# Altium project Quadcopter Fligth Controller Board.PrjPcb (part 3 of 7)
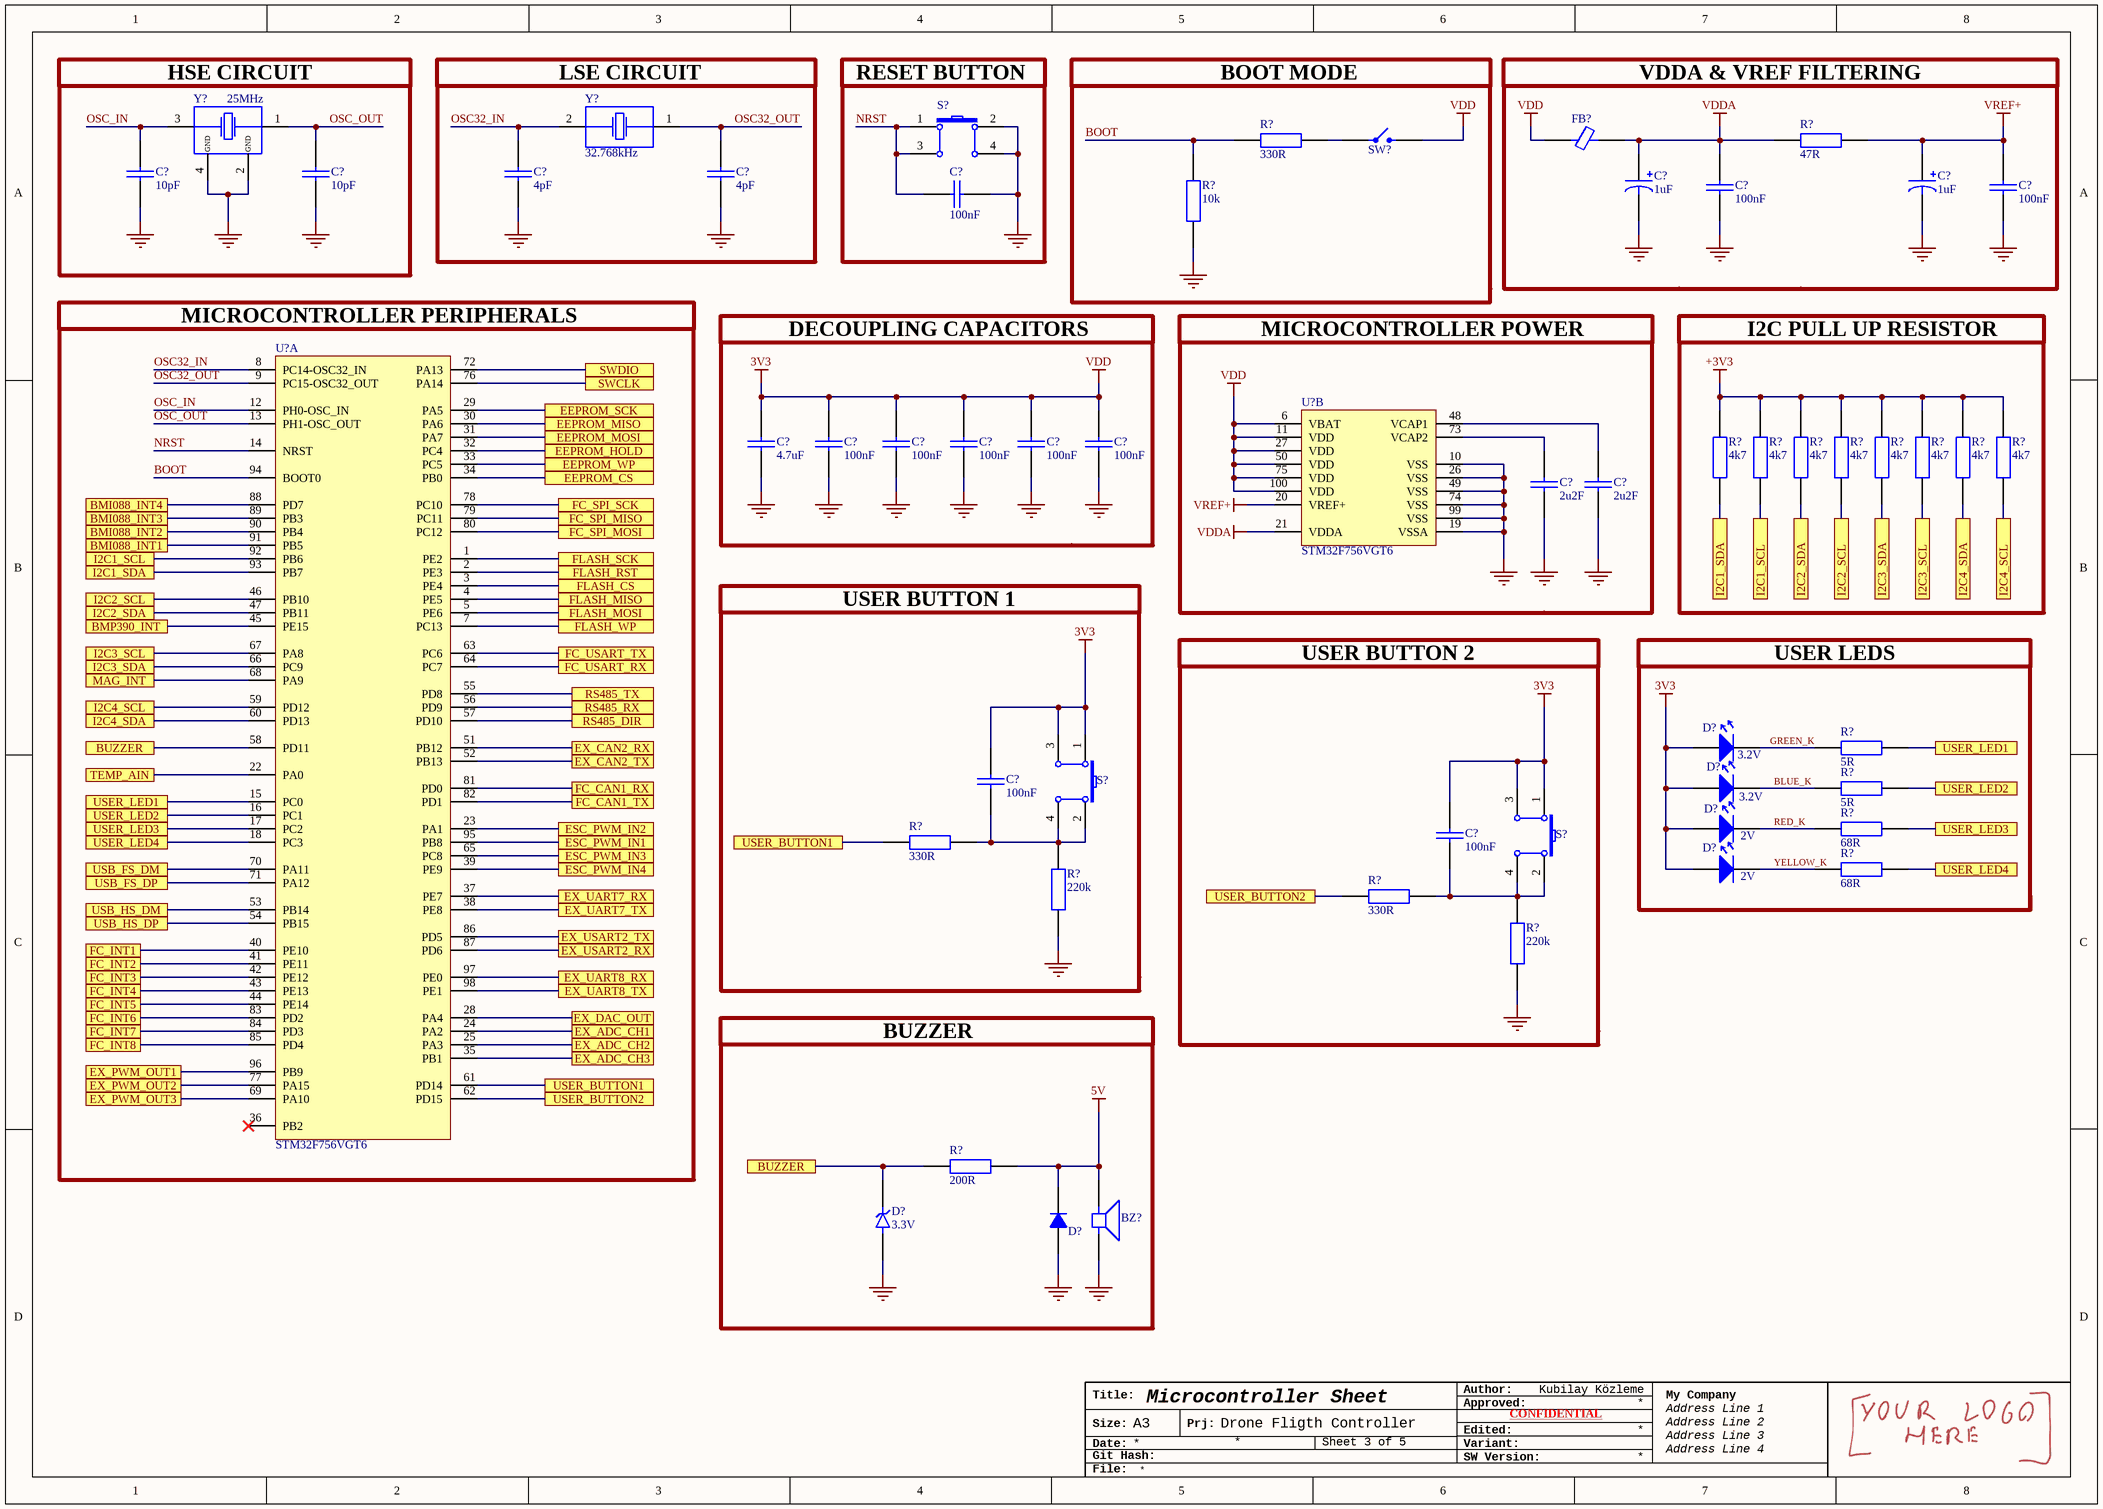
[diagram p5: Microcontroller.SchDoc]

## Sheet Microcontroller.SchDoc: Microcontroller Sheet (continued)

### Ports
BMI088_INT1 (see Peripherals[3A]), BMI088_INT2 (see Peripherals[3A]), BMI088_INT3 (see Peripherals[3A]), BMI088_INT4 (see Peripherals[3A]), BMP390_INT (see Peripherals[2B]), BUZZER (see Microcontroller[1B]), BUZZER (see Microcontroller[3D]), EEPROM_CS (see Peripherals[3B]), EEPROM_HOLD (see Peripherals[3B]), EEPROM_MISO (see Peripherals[3B]), EEPROM_MOSI (see Peripherals[3B]), EEPROM_SCK (see Peripherals[3B]), EEPROM_WP (see Peripherals[3B]), ESC_PWM_IN1 (see Connector[5A]), ESC_PWM_IN2 (see Connector[6A]), ESC_PWM_IN3 (see Connector[5A]), ESC_PWM_IN4 (see Connector[6A]), EX_ADC_CH1 (see Connector[7C]), EX_ADC_CH2 (see Connector[7C]), EX_ADC_CH3 (see Connector[7C]), EX_CAN2_RX (see Connector[3B]), EX_CAN2_TX (see Connector[3B]), EX_DAC_OUT (see Connector[7C]), EX_PWM_OUT1 (see Connector[7D]), EX_PWM_OUT2 (see Connector[7D]), EX_PWM_OUT3 (see Connector[7D]), EX_UART7_RX (see Connector[7B]), EX_UART7_TX (see Connector[7B]), EX_UART8_RX (see Connector[7B]), EX_UART8_TX (see Connector[7B]), EX_USART2_RX (see Connector[7A]), EX_USART2_TX (see Connector[7A]), FC_CAN1_RX (see Connector[1B]), FC_CAN1_TX (see Connector[1B]), FC_INT1 (see Connector[1C]), FC_INT2 (see Connector[1C]), FC_INT3 (see Connector[1C]), FC_INT4 (see Connector[1C]), FC_INT5 (see Connector[1C]), FC_INT6 (see Connector[1C]), FC_INT7 (see Connector[1C]), FC_INT8 (see Connector[1C]), FC_SPI_MISO (see Connector[1C]), FC_SPI_MOSI (see Connector[1C]), FC_SPI_SCK (see Connector[1C]), FC_USART_RX (see Connector[1B]), FC_USART_TX (see Connector[1B]), FLASH_CS (see Peripherals[1C]), FLASH_MISO (see Peripherals[1B]), FLASH_MOSI (see Peripherals[1B]), FLASH_RST (see Peripherals[2B]), FLASH_SCK (see Peripherals[1B]), FLASH_WP (see Peripherals[2B]), I2C1_SCL (see Microcontroller[1B], Peripherals[1A]), I2C1_SCL (see Microcontroller[7B], Peripherals[1A]), I2C1_SDA (see Microcontroller[1B], Peripherals[1A]), I2C1_SDA (see Microcontroller[7B], Peripherals[1A]), I2C2_SCL (see Microcontroller[1B], Peripherals[2B]), I2C2_SCL (see Microcontroller[8B], Peripherals[2B]), I2C2_SDA (see Microcontroller[1B], Peripherals[2B]), I2C2_SDA (see Microcontroller[7B], Peripherals[2B]), I2C3_SCL (see Microcontroller[1B], Peripherals[5A], Peripherals[5B]), I2C3_SCL (see Microcontroller[8B], Peripherals[5A], Peripherals[5B]), I2C3_SDA (see Microcontroller[1B], Peripherals[5A], Peripherals[5B]), I2C3_SDA (see Microcontroller[8B], Peripherals[5A], Peripherals[5B]), I2C4_SCL (see Connector[1B], Connector[7C], Microcontroller[1B]), I2C4_SCL (see Connector[1B], Connector[7C], Microcontroller[8B]), I2C4_SDA (see Connector[1B], Connector[7C], Microcontroller[1B]), I2C4_SDA (see Connector[1B], Connector[7C], Microcontroller[8B]), MAG_INT (see Peripherals[5A]), RS485_DIR, RS485_RX, RS485_TX, SWCLK (see Connector[2D]), SWDIO (see Connector[2D]), TEMP_AIN, USB_FS_DM (see Connector[4A]), USB_FS_DP (see Connector[4A]), USB_HS_DM (see Connector[6C]), USB_HS_DP (see Connector[6C]), USER_BUTTON1 (see Microcontroller[3C]), USER_BUTTON2 (see Microcontroller[3C]), USER_BUTTON2 (see Microcontroller[5C]), USER_LED1 (see Microcontroller[1C]), USER_LED1 (see Microcontroller[8B]), USER_LED2 (see Microcontroller[1C]), USER_LED2 (see Microcontroller[8C]), USER_LED3 (see Microcontroller[1C]), USER_LED3 (see Microcontroller[8C]), USER_LED4 (see Microcontroller[1C]), USER_LED4 (see Microcontroller[8C])

### Nets
3V3: C?#38.2 C?#39.2 C?#40.2 C?#41.2 C?#42.2 C?#43.2 C?#46.2 C?#47.2 D?#2.2(A) D?#3.2(A) D?#4.2(A) D?#5.2(A) FB?#2.1 S?#2.1 S?#2.3 S?#3.1 S?#3.3 SW?.1 U?#4.6(VBAT) U?#4.11(VDD) U?#4.27(VDD) U?#4.50(VDD) U?#4.75(VDD) U?#4.100(VDD)  [also labelled VDD]
5V: BZ?.1(+) D?#6.1 R?#29.1
+3V3: R?#13.2 R?#14.2 R?#15.2 R?#16.2 R?#17.2 R?#18.2 R?#19.2 R?#20.2
GND: BZ?.2(-) C?#29.2 C?#30.2 C?#31.2 C?#32.2 C?#33.2 C?#34.1 C?#35.1 C?#36.1 C?#37.1 C?#38.1 C?#39.1 C?#40.1 C?#41.1 C?#42.1 C?#43.1 C?#44.1 C?#45.1 D?#6.2 D?#7.A R?#12.1 R?#27.1 R?#28.1 S?#1.2 S?#1.4 U?#4.10(VSS) U?#4.19(VSSA) U?#4.26(VSS) U?#4.49(VSS) U?#4.74(VSS) U?#4.99(VSS) Y?#1.2(GND) Y?#1.4(GND)  [project net BUCK_GND1]
VDDA: C?#31.1 C?#36.2 FB?#2.2 R?#11.1 U?#4.21(VDDA)
VREF+: C?#32.1 C?#37.2 R?#11.2 U?#4.20(VREF+)
BLUE_K: D?#3.1(K) R?#22.1
BOOT: R?#10.1 R?#12.2 U?#3.94(BOOT0)
GREEN_K: D?#2.1(K) R?#21.1
NRST: C?#33.1 S?#1.1 S?#1.3 U?#3.14(NRST)
OSC32_IN: C?#34.2 U?#3.8(PC14-OSC32_IN) Y?#2.2
OSC32_OUT: C?#35.2 U?#3.9(PC15-OSC32_OUT) Y?#2.1
OSC_IN: C?#29.1 U?#3.12(PH0-OSC_IN) Y?#1.3
OSC_OUT: C?#30.1 U?#3.13(PH1-OSC_OUT) Y?#1.1
RED_K: D?#4.1(K) R?#23.1
YELLOW_K: D?#5.1(K) R?#25.1
NetC?#44_2: C?#44.2 U?#4.73(VCAP2)
NetC?#45_2: C?#45.2 U?#4.48(VCAP1)
NetC?#46_1: C?#46.1 R?#24.1 R?#27.2 S?#2.2 S?#2.4
NetC?#47_1: C?#47.1 R?#26.1 R?#28.2 S?#3.2 S?#3.4
NetD?#7_K: D?#7.K R?#29.2 U?#3.58(PD11) ; port BUZZER
NetJ?#2_1: U?#3.95(PB8) ; port ESC_PWM_IN1
NetJ?#3_1: U?#3.23(PA1) ; port ESC_PWM_IN2
NetJ?#5_1: U?#3.65(PC8) ; port ESC_PWM_IN3
NetJ?#6_1: U?#3.39(PE9) ; port ESC_PWM_IN4
NetJ?#21_2: U?#3.72(PA13) ; port SWDIO
NetJ?#21_3: U?#3.76(PA14) ; port SWCLK
NetR?#10_2: R?#10.2 SW?.2
NetR?#13_1: R?#13.1 U?#3.93(PB7) ; port I2C1_SDA
NetR?#14_1: R?#14.1 U?#3.92(PB6) ; port I2C1_SCL
NetR?#15_1: R?#15.1 U?#3.47(PB11) ; port I2C2_SDA
NetR?#16_1: R?#16.1 U?#3.46(PB10) ; port I2C2_SCL
NetR?#17_1: R?#17.1 U?#3.66(PC9) ; port I2C3_SDA
NetR?#18_1: R?#18.1 U?#3.67(PA8) ; port I2C3_SCL
NetR?#19_1: R?#19.1 U?#3.60(PD13) ; port I2C4_SDA
NetR?#20_1: R?#20.1 U?#3.59(PD12) ; port I2C4_SCL
NetR?#21_2: R?#21.2 U?#3.15(PC0) ; port USER_LED1
NetR?#22_2: R?#22.2 U?#3.16(PC1) ; port USER_LED2
NetR?#23_2: R?#23.2 U?#3.17(PC2) ; port USER_LED3
NetR?#24_2: R?#24.2 U?#3.61(PD14) ; port USER_BUTTON1
NetR?#25_2: R?#25.2 U?#3.18(PC3) ; port USER_LED4
NetR?#26_2: R?#26.2 U?#3.62(PD15) ; port USER_BUTTON2
NetR?#30_1: U?#3.86(PD5) ; port EX_USART2_TX
NetR?#32_1: U?#3.87(PD6) ; port EX_USART2_RX
NetR?#34_1: U?#3.97(PE0) ; port EX_UART8_RX
NetR?#37_1: U?#3.98(PE1) ; port EX_UART8_TX
NetR?#38_1: U?#3.81(PD0) ; port FC_CAN1_RX
NetR?#39_1: U?#3.51(PB12) ; port EX_CAN2_RX
NetR?#40_1: U?#3.82(PD1) ; port FC_CAN1_TX
NetR?#41_1: U?#3.52(PB13) ; port EX_CAN2_TX
NetR?#42_1: U?#3.37(PE7) ; port EX_UART7_RX
NetR?#43_1: U?#3.38(PE8) ; port EX_UART7_TX
NetR?#44_1: U?#3.63(PC6) ; port FC_USART_TX
NetR?#46_1: U?#3.64(PC7) ; port FC_USART_RX
NetR?#51_1: U?#3.78(PC10) ; port FC_SPI_SCK
NetR?#53_1: U?#3.80(PC12) ; port FC_SPI_MOSI
NetR?#54_1: U?#3.79(PC11) ; port FC_SPI_MISO
NetR?#56_1: U?#3.40(PE10) ; port FC_INT1
NetR?#58_1: U?#3.41(PE11) ; port FC_INT2
NetR?#59_1: U?#3.28(PA4) ; port EX_DAC_OUT
NetR?#60_1: U?#3.42(PE12) ; port FC_INT3
NetR?#61_1: U?#3.24(PA2) ; port EX_ADC_CH1
NetR?#62_1: U?#3.43(PE13) ; port FC_INT4
NetR?#63_1: U?#3.25(PA3) ; port EX_ADC_CH2
NetR?#64_1: U?#3.44(PE14) ; port FC_INT5
NetR?#65_1: U?#3.35(PB1) ; port EX_ADC_CH3
NetR?#66_1: U?#3.83(PD2) ; port FC_INT6
NetR?#67_1: U?#3.84(PD3) ; port FC_INT7
NetR?#68_1: U?#3.85(PD4) ; port FC_INT8
NetR?#71_1: U?#3.96(PB9) ; port EX_PWM_OUT1
NetR?#72_1: U?#3.77(PA15) ; port EX_PWM_OUT2
NetR?#73_1: U?#3.69(PA10) ; port EX_PWM_OUT3
NetU?#3_1: U?#3.1(PE2) ; port FLASH_SCK
NetU?#3_2: U?#3.2(PE3) ; port FLASH_RST
NetU?#3_3: U?#3.3(PE4) ; port FLASH_CS
NetU?#3_4: U?#3.4(PE5) ; port FLASH_MISO
NetU?#3_5: U?#3.5(PE6) ; port FLASH_MOSI
NetU?#3_7: U?#3.7(PC13) ; port FLASH_WP
NetU?#3_22: U?#3.22(PA0) ; port TEMP_AIN
NetU?#3_29: U?#3.29(PA5) ; port EEPROM_SCK
NetU?#3_30: U?#3.30(PA6) ; port EEPROM_MISO
NetU?#3_31: U?#3.31(PA7) ; port EEPROM_MOSI
NetU?#3_32: U?#3.32(PC4) ; port EEPROM_HOLD
NetU?#3_33: U?#3.33(PC5) ; port EEPROM_WP
NetU?#3_34: U?#3.34(PB0) ; port EEPROM_CS
NetU?#3_45: U?#3.45(PE15) ; port BMP390_INT
NetU?#3_53: U?#3.53(PB14) ; port USB_HS_DM
NetU?#3_54: U?#3.54(PB15) ; port USB_HS_DP
NetU?#3_55: U?#3.55(PD8) ; port RS485_TX
NetU?#3_56: U?#3.56(PD9) ; port RS485_RX
NetU?#3_57: U?#3.57(PD10) ; port RS485_DIR
NetU?#3_68: U?#3.68(PA9) ; port MAG_INT
NetU?#3_70: U?#3.70(PA11) ; port USB_FS_DM
NetU?#3_71: U?#3.71(PA12) ; port USB_FS_DP
NetU?#3_88: U?#3.88(PD7) ; port BMI088_INT4
NetU?#3_89: U?#3.89(PB3) ; port BMI088_INT3
NetU?#3_90: U?#3.90(PB4) ; port BMI088_INT2
NetU?#3_91: U?#3.91(PB5) ; port BMI088_INT1

Not connected (* = marked no-connect by the designer): U?#3 36(PB2)*

### Notes on the sheet
- VDDA & VREF FILTERING
- DECOUPLING CAPACITORS
- 100nF lık kapasitörler işlemciye yakın yerleştirilecek
- (near U?#3) Yapılacaklar
  - HSE ve LSE kristalleri için load kapasitans değerleri (Cstray = 5nF) alınarak tekrar hesaplanılacak
  -Buzzer ve ledler için ayrı ayrı transistör tabanlı anahtarlama devresi tasarımı yapılacak
  -USB FS ve HS modlarını destekleyen konnektörler seçilecek ve dif hatların şematik tasarımı yapılacak
  -Kullanıcı butonu devreleri yapılacak (1 tane Pull up 1 tane Pull down olmak üzere )
  -Can Bus ve RS485 diferansiyel hatlar için şematik çizimi yapılacak (TVS diyot , ESC koruması ve pi filtera bakılacak)
  -PCA9685PW,118 servo sürücüsü tasarımı yapılacak (Yer Kalmadı Uçuş Bilgisayarında Bu Yapılacak)
- (near C?#43) 100nF lık kapasitörler işlemciye yakın yerleştirilecek
- USER BUTTON 1
- USER BUTTON 2
- USER LEDS
- Title:
- Author:
- Approved:
- Size:
- Date:
- Git Hash:
- A3
- Prj:
- SW Version:
- Variant:
- Edited:
- CONFIDENTIAL
- File: